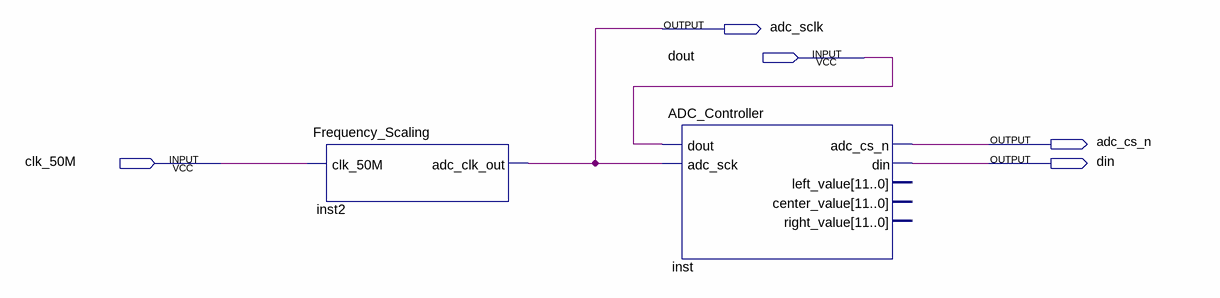
[diagram p0: schematic sheet]
// Quartus schematic LFA_Tester.bdf as structural Verilog: 2 symbols, 5 pins
module LFA_Tester (
  input  dout,
  input  clk_50M,
  output adc_sclk,
  output adc_cs_n,
  output din
);

  Frequency_Scaling inst2 (.clk_50M(clk_50M), .adc_clk_out(adc_sclk));
  ADC_Controller inst (
    .dout(dout), .adc_sck(adc_sclk), .adc_cs_n(adc_cs_n), .din(din));  // open: left_value, center_value, right_value
endmodule
